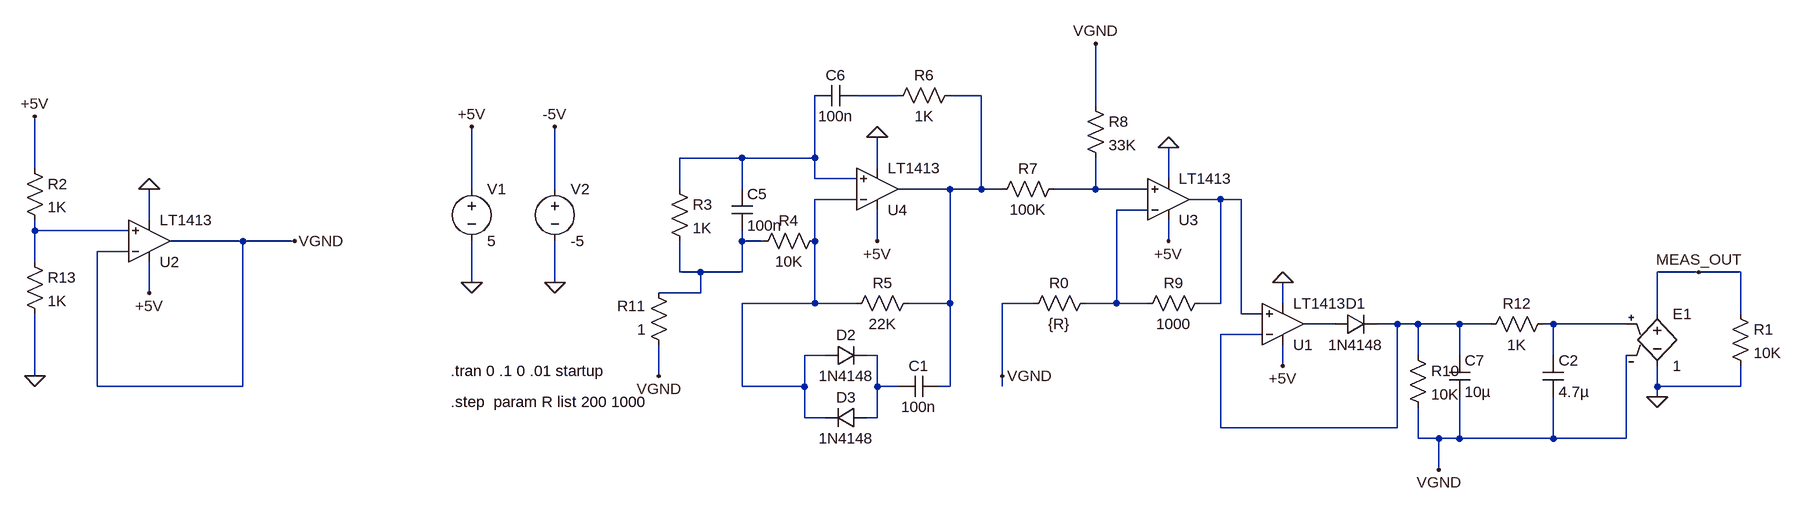
[diagram p0: schematic EC_Float_LT1413.asc]
EC_Float_LT1413.asc, the LTspice schematic file:
Version 4
SHEET 1 1632 684
WIRE 176 -16 112 -16
WIRE 304 -16 256 -16
WIRE 480 0 480 -96
WIRE -64 80 -160 80
WIRE 48 80 48 -16
WIRE 48 80 -64 80
WIRE -1152 96 -1152 16
WIRE 144 96 144 48
WIRE 48 112 48 80
WIRE 112 112 48 112
WIRE 592 112 592 64
WIRE -480 128 -480 32
WIRE -352 128 -352 32
WIRE -160 128 -160 80
WIRE -64 128 -64 80
WIRE 256 128 176 128
WIRE 304 128 304 -16
WIRE 304 128 256 128
WIRE 336 128 304 128
WIRE 480 128 480 80
WIRE 480 128 416 128
WIRE 560 128 480 128
WIRE 112 144 48 144
WIRE 672 144 624 144
WIRE 704 144 672 144
WIRE 560 160 512 160
WIRE -976 176 -976 128
WIRE -1152 192 -1152 176
WIRE -1008 192 -1152 192
WIRE -832 208 -944 208
WIRE -752 208 -832 208
WIRE -64 208 -64 192
WIRE -32 208 -64 208
WIRE 48 208 48 144
WIRE 144 208 144 160
WIRE 592 208 592 176
WIRE -1008 224 -1056 224
WIRE -1152 240 -1152 192
WIRE -160 256 -160 208
WIRE -128 256 -160 256
WIRE -64 256 -64 208
WIRE -64 256 -128 256
WIRE 1408 256 1344 256
WIRE 1472 256 1408 256
WIRE -480 272 -480 208
WIRE -352 272 -352 208
WIRE -976 288 -976 240
WIRE -128 288 -128 256
WIRE -128 288 -192 288
WIRE 48 304 48 208
WIRE 48 304 -64 304
WIRE 112 304 48 304
WIRE 256 304 256 128
WIRE 256 304 192 304
WIRE 384 304 336 304
WIRE 512 304 512 160
WIRE 512 304 464 304
WIRE 560 304 512 304
WIRE 672 304 672 144
WIRE 672 304 640 304
WIRE 768 304 768 272
WIRE 704 320 704 144
WIRE 736 320 704 320
WIRE 1344 320 1344 256
WIRE 1472 320 1472 256
WIRE 848 336 800 336
WIRE 944 336 912 336
WIRE 976 336 944 336
WIRE 1040 336 976 336
WIRE 1088 336 1040 336
WIRE 1184 336 1168 336
WIRE 1296 336 1184 336
WIRE 736 352 672 352
WIRE 64 384 32 384
WIRE 144 384 128 384
WIRE 976 384 976 336
WIRE 1040 384 1040 336
WIRE 1184 384 1184 336
WIRE 768 400 768 368
WIRE -1152 416 -1152 320
WIRE -192 416 -192 368
WIRE 336 416 336 304
WIRE -1056 432 -1056 224
WIRE -832 432 -832 208
WIRE -832 432 -1056 432
WIRE -64 432 -64 304
WIRE 32 432 32 384
WIRE 32 432 -64 432
WIRE 144 432 144 384
WIRE 176 432 144 432
WIRE 256 432 256 304
WIRE 256 432 240 432
WIRE 336 432 336 416
WIRE 1344 432 1344 400
WIRE 1472 432 1472 400
WIRE 1472 432 1344 432
WIRE 1344 448 1344 432
WIRE 32 480 32 432
WIRE 64 480 32 480
WIRE 144 480 144 432
WIRE 144 480 128 480
WIRE 672 496 672 352
WIRE 944 496 944 336
WIRE 944 496 672 496
WIRE 976 512 976 464
WIRE 1008 512 976 512
WIRE 1040 512 1040 448
WIRE 1040 512 1008 512
WIRE 1184 512 1184 448
WIRE 1184 512 1040 512
WIRE 1296 512 1296 384
WIRE 1296 512 1184 512
WIRE 1008 560 1008 512
FLAG 144 208 +5V
FLAG -480 272 0
FLAG -352 272 0
FLAG -480 32 +5V
FLAG -352 32 -5V
FLAG 480 -96 VGND
FLAG 592 64 0
FLAG 592 208 +5V
FLAG 768 400 +5V
FLAG 768 272 0
FLAG 1008 560 VGND
FLAG -752 208 VGND
FLAG -192 416 VGND
FLAG 144 48 0
FLAG 336 416 VGND
FLAG 1344 448 0
FLAG 1408 256 MEAS_OUT
FLAG -976 288 +5V
FLAG -976 128 0
FLAG -1152 16 +5V
FLAG -1152 416 0
SYMBOL res -176 112 R0
SYMATTR InstName R3
SYMATTR Value 1K
SYMBOL res 272 -32 R90
WINDOW 0 0 56 VBottom 2
WINDOW 3 32 56 VTop 2
SYMATTR InstName R6
SYMATTR Value 1K
SYMBOL res 64 192 R90
WINDOW 0 0 56 VBottom 2
WINDOW 3 32 56 VTop 2
SYMATTR InstName R4
SYMATTR Value 10K
SYMBOL res 208 288 R90
WINDOW 0 0 56 VBottom 2
WINDOW 3 32 56 VTop 2
SYMATTR InstName R5
SYMATTR Value 22K
SYMBOL res 432 112 R90
WINDOW 0 0 56 VBottom 2
WINDOW 3 32 56 VTop 2
SYMATTR InstName R7
SYMATTR Value 100K
SYMBOL res 464 -16 R0
SYMATTR InstName R8
SYMATTR Value 33K
SYMBOL cap -80 128 R0
SYMATTR InstName C5
SYMATTR Value 100n
SYMBOL cap 112 -32 R90
WINDOW 0 0 32 VBottom 2
WINDOW 3 32 32 VTop 2
SYMATTR InstName C6
SYMATTR Value 100n
SYMBOL voltage -480 112 R0
WINDOW 123 0 0 Left 2
WINDOW 39 0 0 Left 2
SYMATTR InstName V1
SYMATTR Value 5
SYMBOL voltage -352 112 R0
WINDOW 123 0 0 Left 2
WINDOW 39 0 0 Left 2
SYMATTR InstName V2
SYMATTR Value -5
SYMBOL diode 848 352 R270
WINDOW 0 32 32 VTop 2
WINDOW 3 0 32 VBottom 2
SYMATTR InstName D1
SYMATTR Value 1N4148
SYMBOL res 656 288 R90
WINDOW 0 0 56 VBottom 2
WINDOW 3 32 56 VTop 2
SYMATTR InstName R9
SYMATTR Value 1000
SYMBOL res 480 288 R90
WINDOW 0 0 56 VBottom 2
WINDOW 3 32 56 VTop 2
SYMATTR InstName R0
SYMATTR Value {R}
SYMBOL cap 240 416 R90
WINDOW 0 0 32 VBottom 2
WINDOW 3 32 32 VTop 2
SYMATTR InstName C1
SYMATTR Value 100n
SYMBOL diode 64 400 R270
WINDOW 0 32 32 VTop 2
WINDOW 3 0 32 VBottom 2
SYMATTR InstName D2
SYMATTR Value 1N4148
SYMBOL diode 128 496 M270
WINDOW 0 32 32 VTop 2
WINDOW 3 0 32 VBottom 2
SYMATTR InstName D3
SYMATTR Value 1N4148
SYMBOL res 960 368 R0
SYMATTR InstName R10
SYMATTR Value 10K
SYMBOL cap 1024 384 R0
SYMATTR InstName C7
SYMATTR Value 10µ
SYMBOL res -176 384 R180
WINDOW 0 36 76 Left 2
WINDOW 3 36 40 Left 2
SYMATTR InstName R11
SYMATTR Value 1
SYMBOL Opamps\\LT1413 768 400 M180
SYMATTR InstName U1
SYMBOL Opamps\\LT1413 592 208 M180
SYMATTR InstName U3
SYMBOL Opamps\\LT1413 144 192 M180
SYMATTR InstName U4
SYMBOL res 1184 320 R90
WINDOW 0 0 56 VBottom 2
WINDOW 3 32 56 VTop 2
SYMATTR InstName R12
SYMATTR Value 1K
SYMBOL cap 1168 384 R0
SYMATTR InstName C2
SYMATTR Value 4.7µ
SYMBOL e 1344 304 R0
SYMATTR InstName E1
SYMATTR Value 1
SYMBOL res 1456 304 R0
SYMATTR InstName R1
SYMATTR Value 10K
SYMBOL Opamps\\LT1413 -976 272 M180
SYMATTR InstName U2
SYMBOL res -1168 80 R0
SYMATTR InstName R2
SYMATTR Value 1K
SYMBOL res -1168 224 R0
SYMATTR InstName R13
SYMATTR Value 1K
TEXT -512 408 Left 2 !.tran 0 .1 0 .01 startup
TEXT -512 456 Left 2 !.step  param R list 200 1000

The netlist it stands for:
* EC_Float_LT1413.asc
R3 N003 N009 1K
R6 N002 N001 1K
R4 N005 N009 10K
R5 N002 N005 22K
R7 N004 N002 100K
R8 VGND N004 33K
C5 N003 N009 100n
C6 N001 N003 100n
V1 +5V 0 5
V2 -5V 0 -5
D1 N010 N011 1N4148
R9 N006 N007 1000
R0 N007 VGND {R}
C1 N002 N013 100n
D2 N005 N013 1N4148
D3 N013 N005 1N4148
R10 N011 VGND 10K
C7 N011 VGND 10µ
R11 VGND N009 1
XU1 N006 N011 +5V 0 N010 LT1413  ; pins In+ In- V+ V- OUT
XU3 N004 N007 +5V 0 N006 LT1413  ; pins In+ In- V+ V- OUT
XU4 N003 N005 +5V 0 N002 LT1413  ; pins In+ In- V+ V- OUT
R12 N012 N011 1K
C2 N012 VGND 4.7µ
E1 MEAS_OUT 0 N012 VGND 1
R1 MEAS_OUT 0 10K
XU2 N008 VGND +5V 0 VGND LT1413  ; pins In+ In- V+ V- OUT
R2 +5V N008 1K
R13 N008 0 1K
.model D D
.lib standard.dio
.tran 0 .1 0 .01 startup
.step  param R list 200 1000
.lib LTC.lib
.backanno
.end